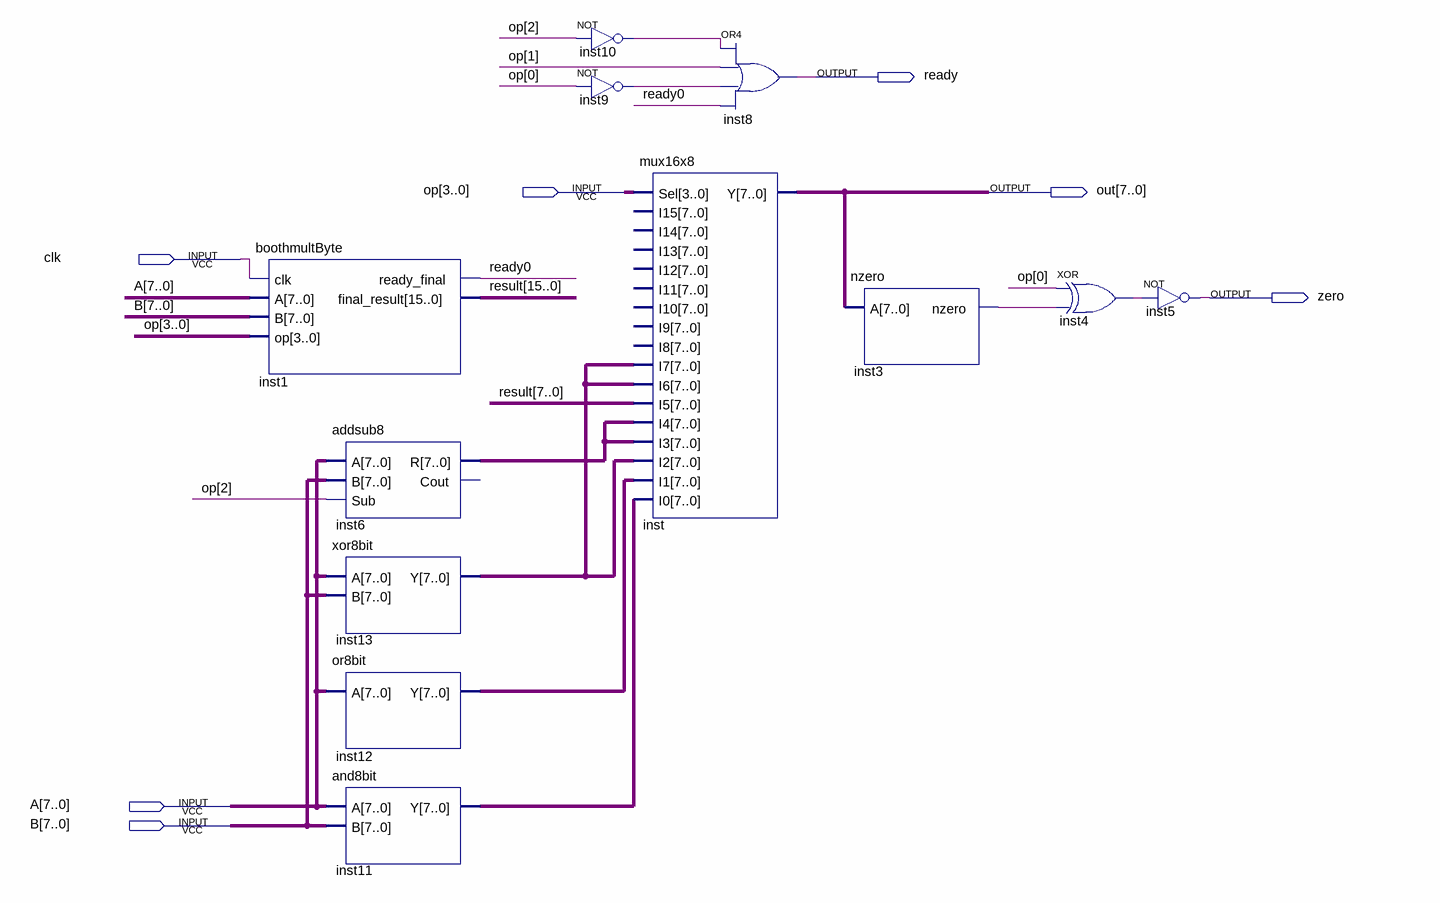
[diagram p0: schematic sheet]
// Quartus schematic ALU.bdf as structural Verilog: 12 symbols, 7 pins
module ALU (
  input  [3:0] op,
  input  clk,
  input  [7:0] A,
  input  [7:0] B,
  output ready,
  output [7:0] out,
  output zero
);

  wire inst3_nzero, inst4_out, inst9_out, inst10_out, ready0;
  wire [7:0] inst6_r, inst11_y, inst12_y, inst13_y;
  wire [15:0] result;

  boothmultByte inst1 (.clk(clk), .A(A), .B(B), .op(op), .ready_final(ready0), .final_result(result));
  addsub8 inst6 (.A(A), .B(B), .Sub(op[2]), .R(inst6_r));  // open: Cout
  xor8bit inst13 (.A(A), .B(B), .Y(inst13_y));
  or8bit inst12 (.A(A), .Y(inst12_y));
  and8bit inst11 (.A(A), .B(B), .Y(inst11_y));
  not inst10 (inst10_out, op[2]);
  not inst9 (inst9_out, op[0]);
  mux16x8 inst (
    .Sel(op), .I7(inst13_y), .I6(inst13_y), .I5(result[7:0]), .I4(inst6_r), .I3(inst6_r), .I2(inst13_y),
    .I1(inst12_y), .I0(inst11_y), .Y(out));  // open: I15, I14, I13, I12, I11, I10, I9, I8
  or inst8 (ready, inst10_out, op[1], inst9_out, ready0);
  nzero inst3 (.A(out), .nzero(inst3_nzero));
  xor inst4 (inst4_out, op[0], inst3_nzero);
  not inst5 (zero, inst4_out);
endmodule
